# Altium schematic sheet Dogfish3D - Power.SchDoc
size A
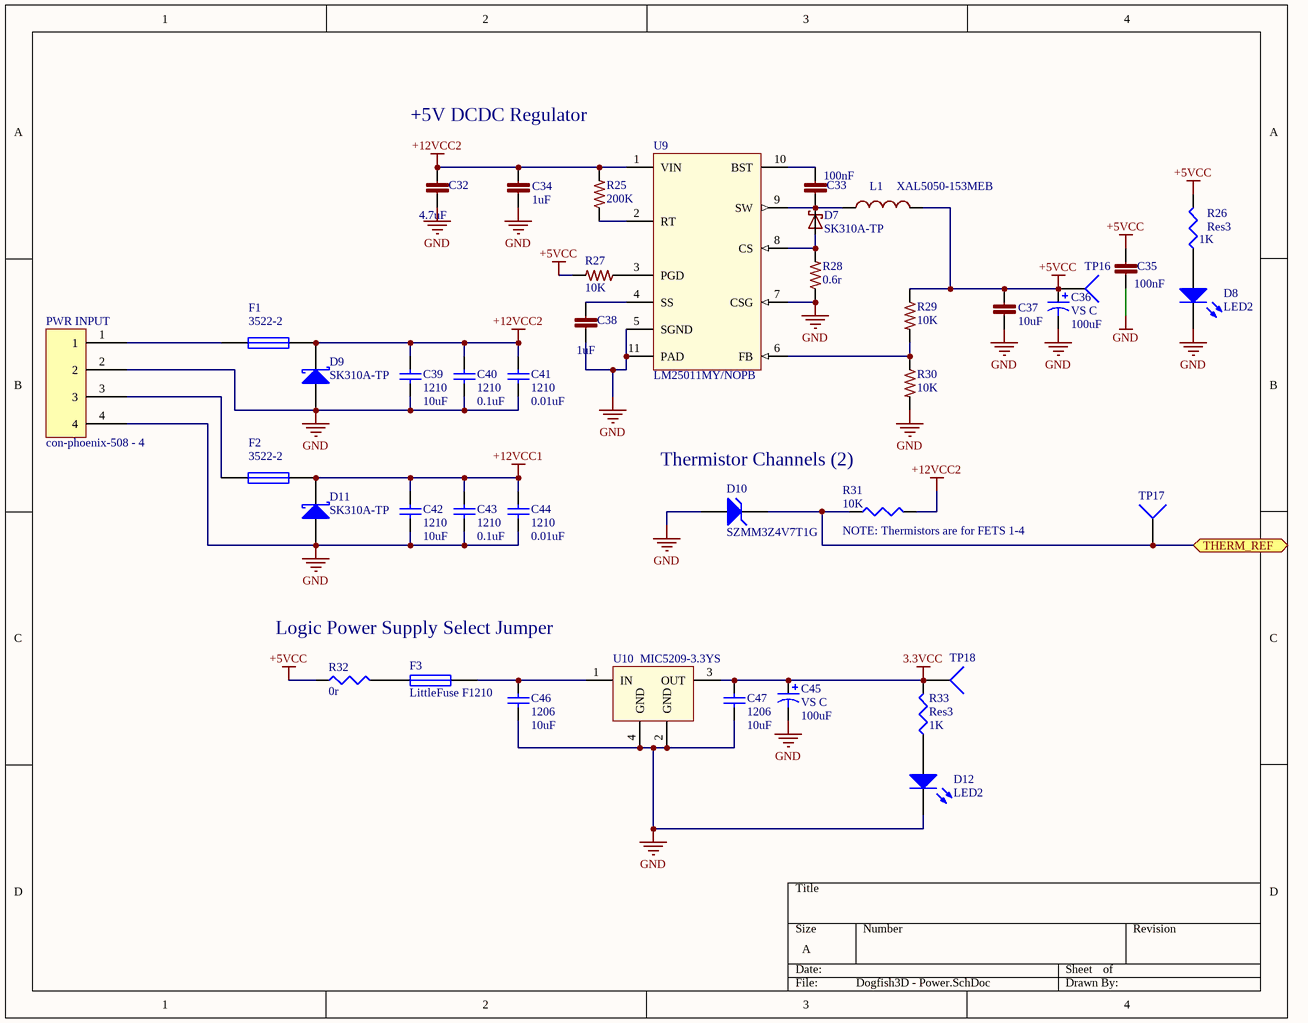
[diagram p0: Dogfish3D - Power.SchDoc]

## Parts
C32  4.7uF  [C1206]
C33  100nF  [C0603]
C34  1uF  [C0805]
C35  100nF  [C0603]
C36  VS C  value 100uF  [Panasonic VS C]
C37  10uF  [C0805]
C38  1uF  [C0402]
C39  1210  value 10uF  [C1210]
C40  1210  value 0.1uF  [C1210]
C41  1210  value 0.01uF  [C1210]
C42  1210  value 10uF  [C1210]
C43  1210  value 0.1uF  [C1210]
C44  1210  value 0.01uF  [C1210]
C45  VS C  value 100uF  [Panasonic VS C]
C46  1206  value 10uF  [C1206]
C47  1206  value 10uF  [C1206]
D7  SK310A-TP  [SMA-SM]
D8  LED2  [SM 0805 polarized]
D9  SK310A-TP  [SK310A-TP]
D10  SZMM3Z4V7T1G  [SZMM3Z4V7T1G]
D11  SK310A-TP  [SK310A-TP]
D12  LED2  [SM 0805 polarized]
F1  3522-2  [3522-2 - WAVE SOLDER]
F2  3522-2  [3522-2 - WAVE SOLDER]
F3  LittleFuse F1210  [F1210_M]
L1  XAL5050-153MEB  [XAL50xx-153]
PWR_INPUT  con-phoenix-508 - 4  [MSTBV4]
R25  200K  [R0402]
R26  Res3  value 1K  [SM 0805 - gap trimmed]
R27  10K  [R0603]
R28  0.6r  [2512R-0.55]
R29  10K  [R0603]
R30  10K  [R0603]
R31  value 10K  [J1-0603]  (hidden comment: Res3)
R32  value 0r  [SM 0805 - gap trimmed]  (hidden comment: Res3)
R33  Res3  value 1K  [SM 0805 - gap trimmed]
TP16  TP4  [TP-2]  (value not drawn)
TP17  TP4  [TP-2]  (value not drawn)
TP18  TP4  [TP-2]  (value not drawn)
U9  LM25011MY/NOPB  [VSSOP10]
U10  MIC5209-3.3YS  [SOT230P700X190-4N]

## Ports
THERM_REF

## Nets
3.3VCC: C45.1 C47.2 R33.2 TP18.1 U10.3(OUT)
+5VCC: C35.1 C36.1 C37.1 L1.2 R26.2 R27.2 R29.1 R32.1 TP16.1
+12VCC1: C42.2 C43.2 C44.2 D11.2(K) F2.2
+12VCC2: C32.1 C34.1 C39.2 C40.2 C41.2 D9.2(K) F1.2 R25.2 R31.2 U9.1(VIN)
GND: C32.2 C34.2 C35.2 C36.2 C37.2 C38.2 C39.1 C40.1 C41.1 C42.1 C43.1 C44.1 C45.2 C46.1 C47.1 D8.1(A) D9.1(A) D10.1(A) D11.1(A) D12.1(A) PWR_INPUT.2 PWR_INPUT.4 R28.1 R30.2 U9.5(SGND) U9.7(CSG) U9.11(PAD) U10.2(GND) U10.4(GND)
THERM_REF: D10.2(K) R31.1 TP17.1 ; port THERM_REF
NetC33_1: C33.1 U9.10(BST)
NetC33_2: C33.2 D7.C L1.1 U9.9(SW)
NetC38_1: C38.1 U9.4(SS)
NetC46_2: C46.2 F3.1 U10.1(IN)
NetD7_A: D7.A R28.2 U9.8(CS)
NetD8_2: D8.2(K) R26.1
NetD12_2: D12.2(K) R33.1
NetF1_1: F1.1 PWR_INPUT.1
NetF2_1: F2.1 PWR_INPUT.3
NetF3_2: F3.2 R32.2
NetR25_1: R25.1 U9.2(RT)
NetR27_1: R27.1 U9.3(PGD)
NetR29_2: R29.2 R30.1 U9.6(FB)

## Notes on the sheet
- +5V DCDC Regulator
- Thermistor Channels (2)
- (near R31) NOTE: Thermistors are for FETS 1-4
- Logic Power Supply Select Jumper

## Library data of the parts
C32 = C1206C475K5PACTU: CAP CER 1206 4.7uF 50V 10% X5R; LastRevisionNote: ImportComponents; Published: 23-Apr-2014; Publisher: UltiMachine; LastRevisionDate: 23-Apr-2014; ManufacturerPartNumber: C1206C475K5PACTU; VALUE: 4.7uF
C33 C35 = C0603C104K5RACTU: CAP CER 0603 100nF 50V 10% X7R; LastRevisionNote: ImportComponents; Published: 23-Apr-2014; Publisher: UltiMachine; LastRevisionDate: 23-Apr-2014; ManufacturerPartNumber: C0603C104K5RACTU; VALUE: 100nF
C34 = GRM21BR71H105KA12L: CAP CER 0805 1uF 50V 10% X7R; LastRevisionNote: ImportComponents; Published: 23-Apr-2014; Publisher: UltiMachine; LastRevisionDate: 23-Apr-2014; ManufacturerPartNumber: GRM21BR71H105KA12L; VALUE: 1uF
C36 C45 = Cap Pol3: Polarized Capacitor (Surface Mount); Published: 8-Jun-2000; LatestRevisionDate: 29-May-2009; LatestRevisionNote: IPC-7351 Footprint Added.; PackageReference: C0805; Publisher: Altium Limited; PackageDescription: Chip Capacitor
C37 = C0805C106K8PACTU: CAP CER 0805 10uF 10V 10% X5R; LastRevisionNote: ImportComponents; Published: 23-Apr-2014; Publisher: UltiMachine; LastRevisionDate: 23-Apr-2014; ManufacturerPartNumber: C0805C106K8PACTU; VALUE: 10uF
C38 = GRM155R60J105KE19D: CAP CER 0402 1uF 6.3V 10% X5R; LastRevisionNote: ImportComponents; Published: 23-Apr-2014; Publisher: UltiMachine; LastRevisionDate: 23-Apr-2014; ManufacturerPartNumber: GRM155R60J105KE19D; VALUE: 1uF
C39-C44 C46 C47 = Cap Semi: Capacitor (Semiconductor SIM Model); Published: 8-Jun-2000; LatestRevisionDate: 29-May-2009; LatestRevisionNote: IPC-7351 Footprint Added.; PackageReference: C1206; Publisher: Altium Limited; PackageDescription: Chip Capacitor
D7 = SK310A: DIODE Schottky 3A SMA; LastRevisionNote: ImportComponents; LastRevisionDate: 23-Apr-2014; ManufacturerPartNumber: SK310A; Published: 23-Apr-2014; Publisher: UltiMachine
D8 D12 = LED2: Typical RED, GREEN, YELLOW, AMBER GaAs LED; Published: 8-Jun-2000; LatestRevisionDate: 17-Jul-2002; LatestRevisionNote: Re-released for DXP Platform.; PackageVersion: Feb-2002; PackageReference: 3.2X1.6X1.1; Publisher: Altium Limited; PackageDescription: SM LED; 2 Flat Leads
D9 D11 = D Schottky: Schottky Diode; Published: 8-Jun-2000; LatestRevisionDate: 17-Jul-2002; LatestRevisionNote: Re-released for DXP Platform.; PackageReference: SMB; Publisher: Altium Limited; PackageDescription: DO-214-AA/SMB; 2 C-Bend Leads; Body 5.3 x 3.6 mm, inc. leads (LxW); Code_JEDEC: DO-214-AA
D10 = D Zener: Zener Diode; Published: 8-Jun-2000; LatestRevisionDate: 17-Jul-2002; LatestRevisionNote: Re-released for DXP Platform.; PackageReference: DIODE-0.7; Publisher: Altium Limited; PackageDescription: Diode, Thru-Hole; 2 Leads; 0.7 in Pin Spacing
F1-F3 = Fuse 1: Fuse; Published: 8-Jun-2000; LatestRevisionDate: 17-Jul-2002; LatestRevisionNote: Re-released for DXP Platform.; PackageReference: PIN-W2/E2.8; Publisher: Altium Limited; PackageDescription: Thru-Hole; 2 Leads
L1 = XAL5050-153MEB: IND 15uH 3.9A 20%; LastRevisionNote: ImportComponents; Published: 23-Apr-2014; Publisher: UltiMachine; LastRevisionDate: 23-Apr-2014; ManufacturerPartNumber: XAL5050-153MEB; Value: XAL5050-153MEB
PWR_INPUT = con-phoenix-508_4
R25 = CRCW0402200KFKED: RES 0402 22r 63mW 1%; LastRevisionNote: ImportComponents; Published: 23-Apr-2014; Publisher: UltiMachine; LastRevisionDate: 23-Apr-2014; ManufacturerPartNumber: CRCW0402200KFKED; VALUE: 200K
R26 R31-R33 = Res3: Resistor; Published: 8-Jun-2000; LatestRevisionDate: 29-May-2009; LatestRevisionNote: IPC-7351 Footprint Added.; PackageReference: J1-0603; Publisher: Altium Limited; PackageDescription: Chip Resistor
R27 R29 R30 = ERJ-3EKF1002V: RES 0603 10K 100mW 1%; LastRevisionNote: ImportComponents; Published: 23-Apr-2014; Publisher: UltiMachine; LastRevisionDate: 23-Apr-2014; ManufacturerPartNumber: ERJ-3EKF1002V; VALUE: 10K
R28 = RL2512FK-070R06L: RES 0.06 OHM 1W 1% 2512 SMD; LastRevisionNote: ImportComponents; Published: 23-Apr-2014; Publisher: UltiMachine; LastRevisionDate: 23-Apr-2014; ManufacturerPartNumber: RL2512FK-070R06L; VALUE: 0.6r
TP16-TP18 = Socket: LatestRevisionDate: 17-Jul-2002; LatestRevisionNote: Re-released for DXP Platform.; Publisher: Altium Limited
U9 = LM25011: REG BUCK; Value: LM25011MY/NOPB